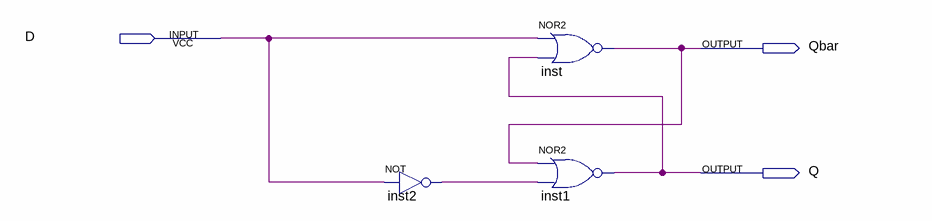
[diagram p0: schematic sheet]
// Quartus schematic D_Latch.bdf as structural Verilog: 3 symbols, 3 pins
module D_Latch (
  input  D,
  output Qbar,
  output Q
);

  wire inst2_out;

  not inst2 (inst2_out, D);
  nor inst (Qbar, D, Q);
  nor inst1 (Q, Qbar, inst2_out);
endmodule
